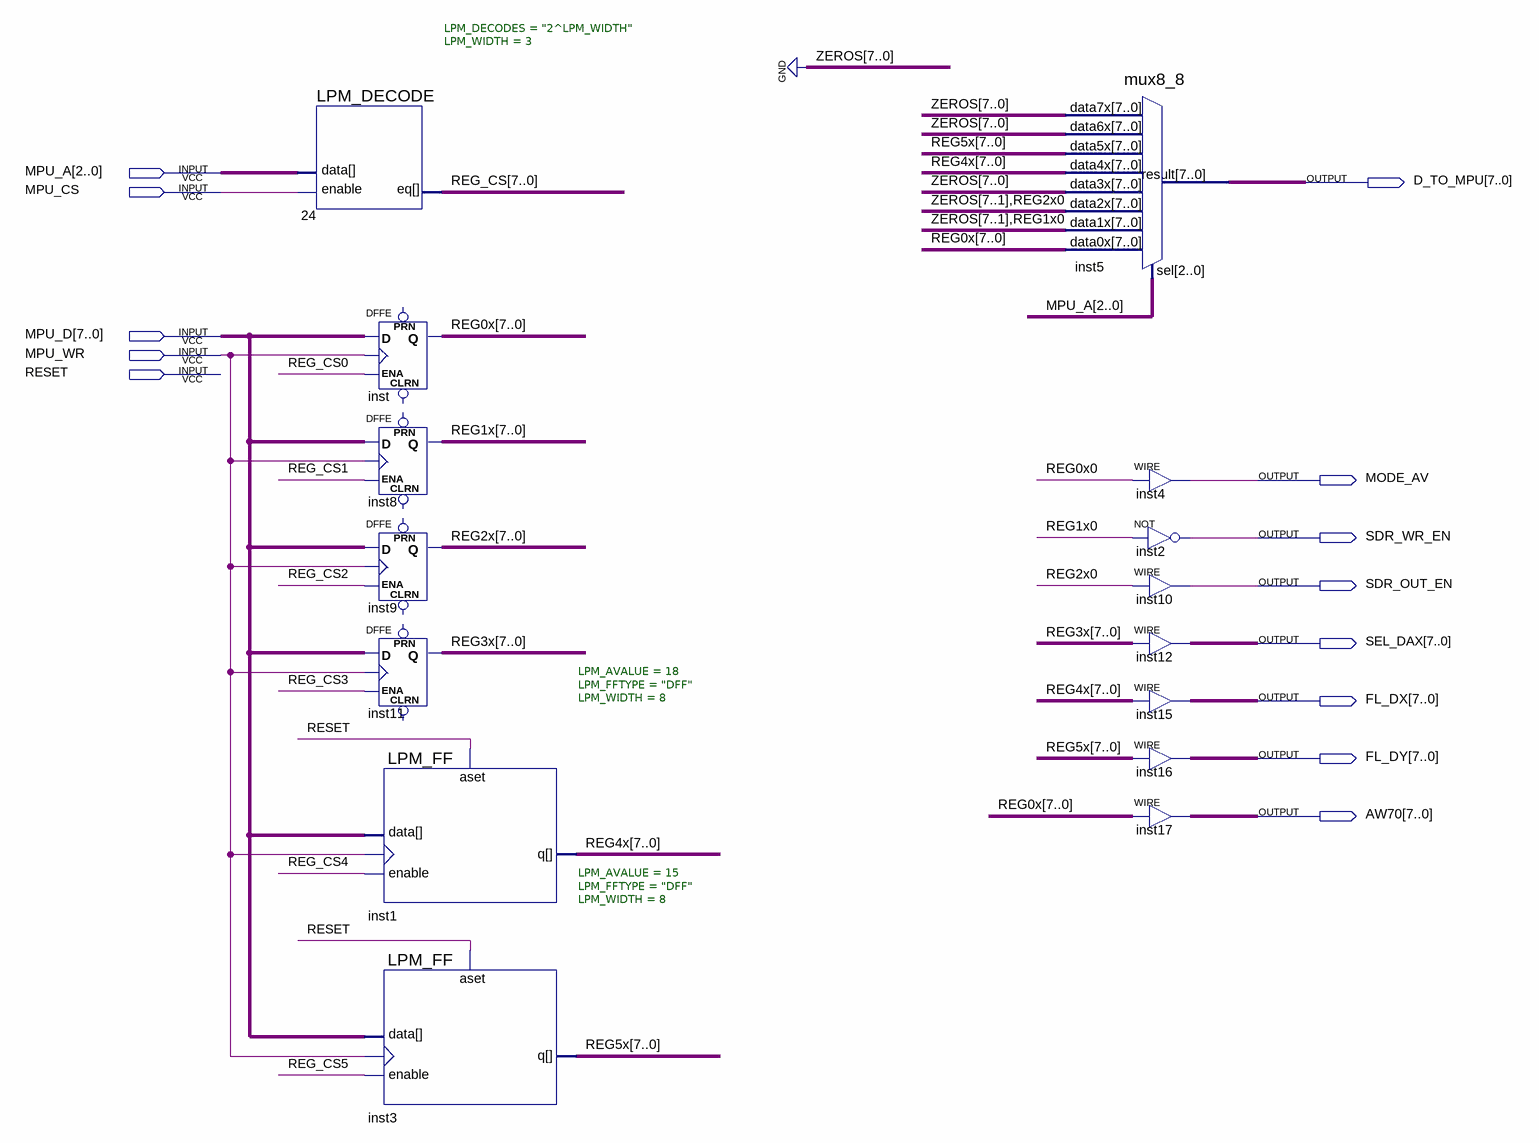
[diagram p0: schematic sheet]
// Quartus schematic dsp_ctrl.bdf as structural Verilog: 15 symbols, 13 pins
module dsp_ctrl (
  input  [2:0] MPU_A,
  input  MPU_CS,
  input  [7:0] MPU_D,
  input  MPU_WR,
  input  RESET,
  output [7:0] D_TO_MPU,
  output MODE_AV,
  output SDR_WR_EN,
  output SDR_OUT_EN,
  output [7:0] SEL_DAX,
  output [7:0] FL_DX,
  output [7:0] FL_DY,
  output [7:0] AW70
);

  wire [7:0] REG0x, REG1x, REG2x, REG3x, REG4x, REG5x, REG_CS;

  LPM_DECODE #(.LPM_DECODES("2^LPM_WIDTH"), .LPM_WIDTH(3)) u_24 (.enable(MPU_CS), .data(MPU_A), .eq(REG_CS));
  DFFE inst[7:0] (.D(MPU_D), .CLK(MPU_WR), .ENA(REG_CS[0]), .Q(REG0x));  // open: PRN, CLRN
  DFFE inst8[7:0] (.D(MPU_D), .CLK(MPU_WR), .ENA(REG_CS[1]), .Q(REG1x));  // open: PRN, CLRN
  DFFE inst9[7:0] (.D(MPU_D), .CLK(MPU_WR), .ENA(REG_CS[2]), .Q(REG2x));  // open: PRN, CLRN
  DFFE inst11[7:0] (.D(MPU_D), .CLK(MPU_WR), .ENA(REG_CS[3]), .Q(REG3x));  // open: PRN, CLRN
  LPM_FF #(.LPM_AVALUE(18), .LPM_FFTYPE("DFF"), .LPM_WIDTH(8)) inst1 (
    .enable(REG_CS[4]), .clock(MPU_WR), .aset(RESET), .data(MPU_D), .q(REG4x));
  LPM_FF #(.LPM_AVALUE(15), .LPM_FFTYPE("DFF"), .LPM_WIDTH(8)) inst3 (
    .enable(REG_CS[5]), .clock(MPU_WR), .aset(RESET), .data(MPU_D), .q(REG5x));
  mux8_8 inst5 (
    .data7x({8{1'b0}}), .data6x({8{1'b0}}), .data5x(REG5x), .data4x(REG4x), .data3x({8{1'b0}}),
    .data2x({{7{1'b0}}, REG2x[0]}), .data1x({{7{1'b0}}, REG1x[0]}), .data0x(REG0x), .sel(MPU_A),
    .result(D_TO_MPU));
  assign MODE_AV = REG0x[0];  // WIRE inst4
  not inst2 (SDR_WR_EN, REG1x[0]);
  assign SDR_OUT_EN = REG2x[0];  // WIRE inst10
  assign SEL_DAX = REG3x;  // WIRE inst12
  assign FL_DX = REG4x;  // WIRE inst15
  assign FL_DY = REG5x;  // WIRE inst16
  assign AW70 = REG0x;  // WIRE inst17
endmodule
